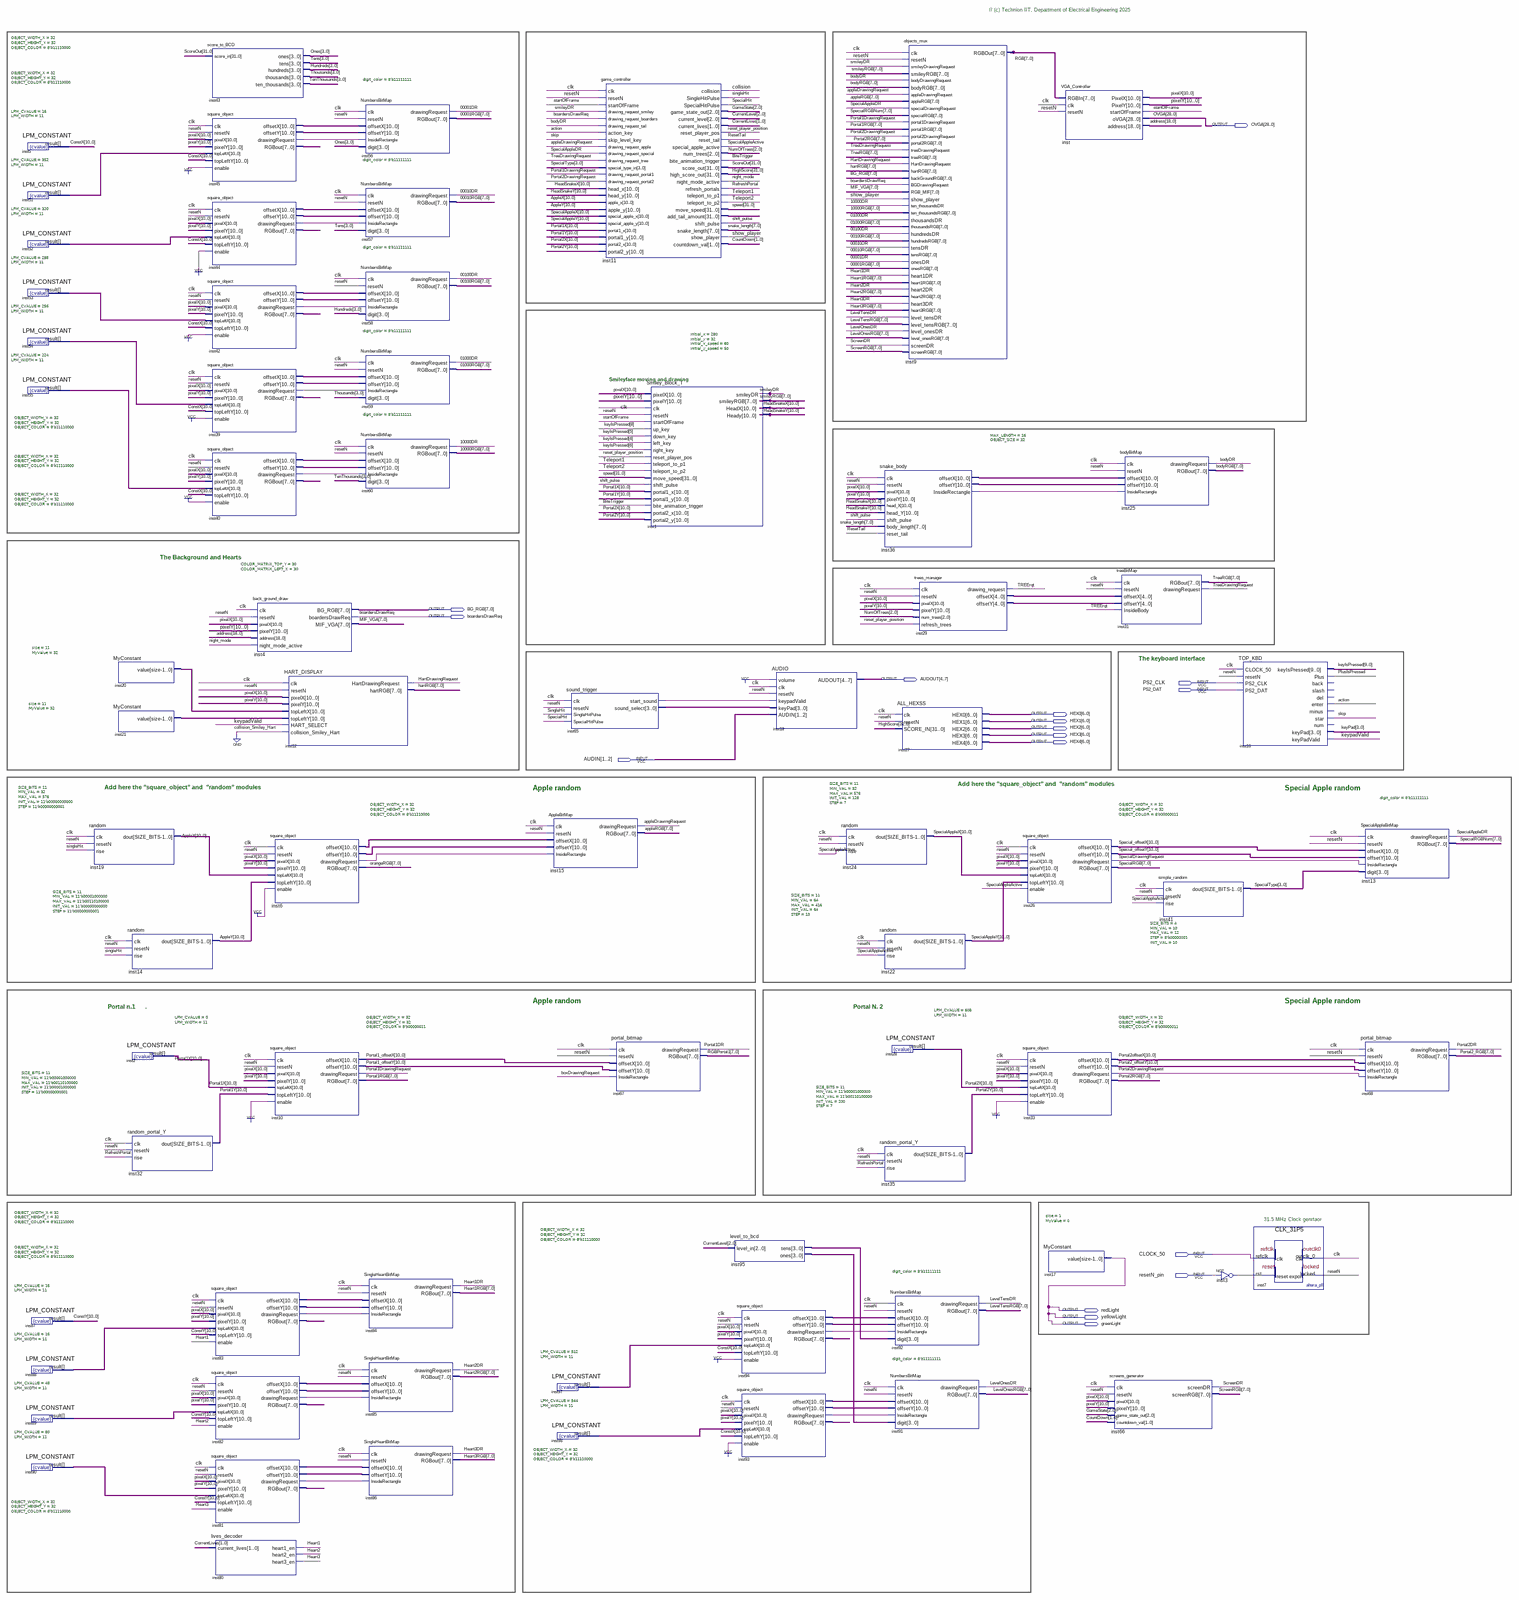
[diagram p0: schematic sheet, whole]
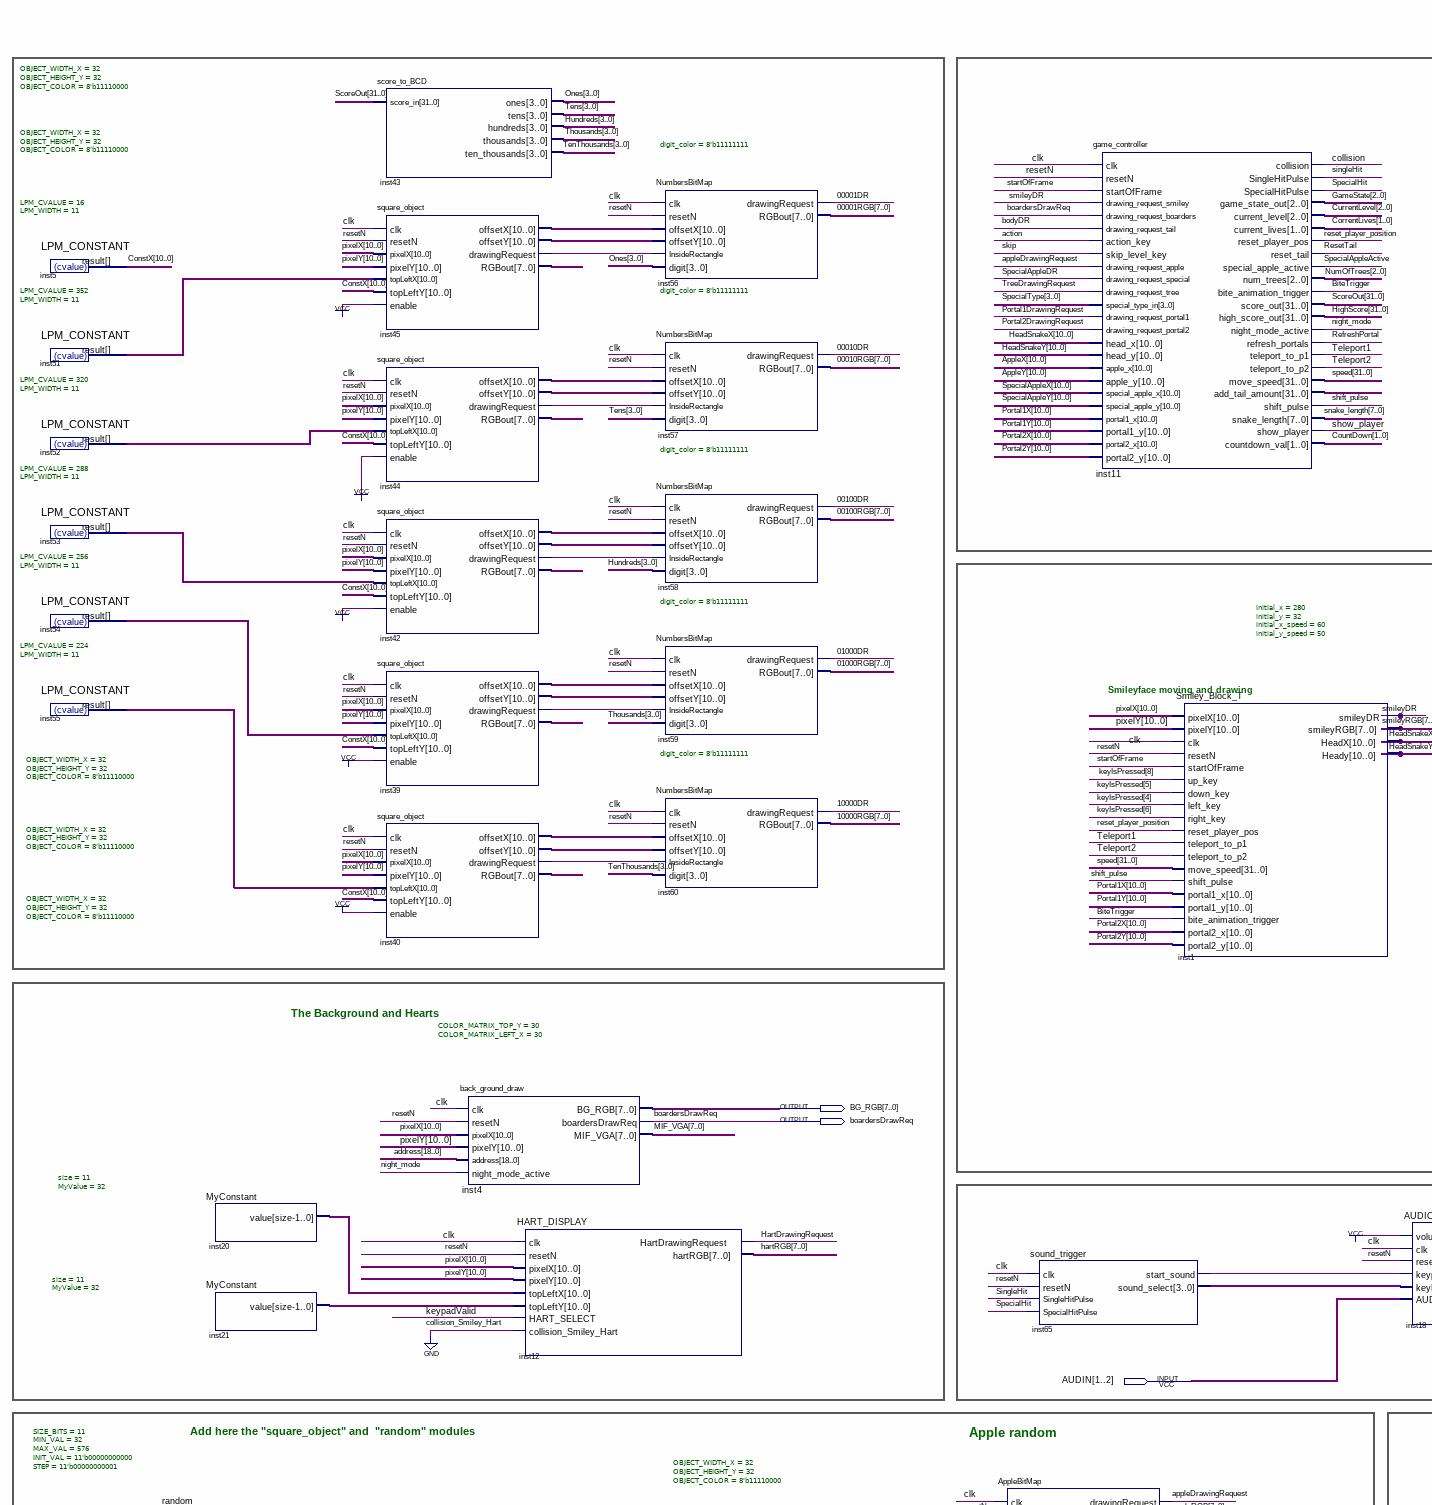
[diagram p1: schematic sheet, upper left part]
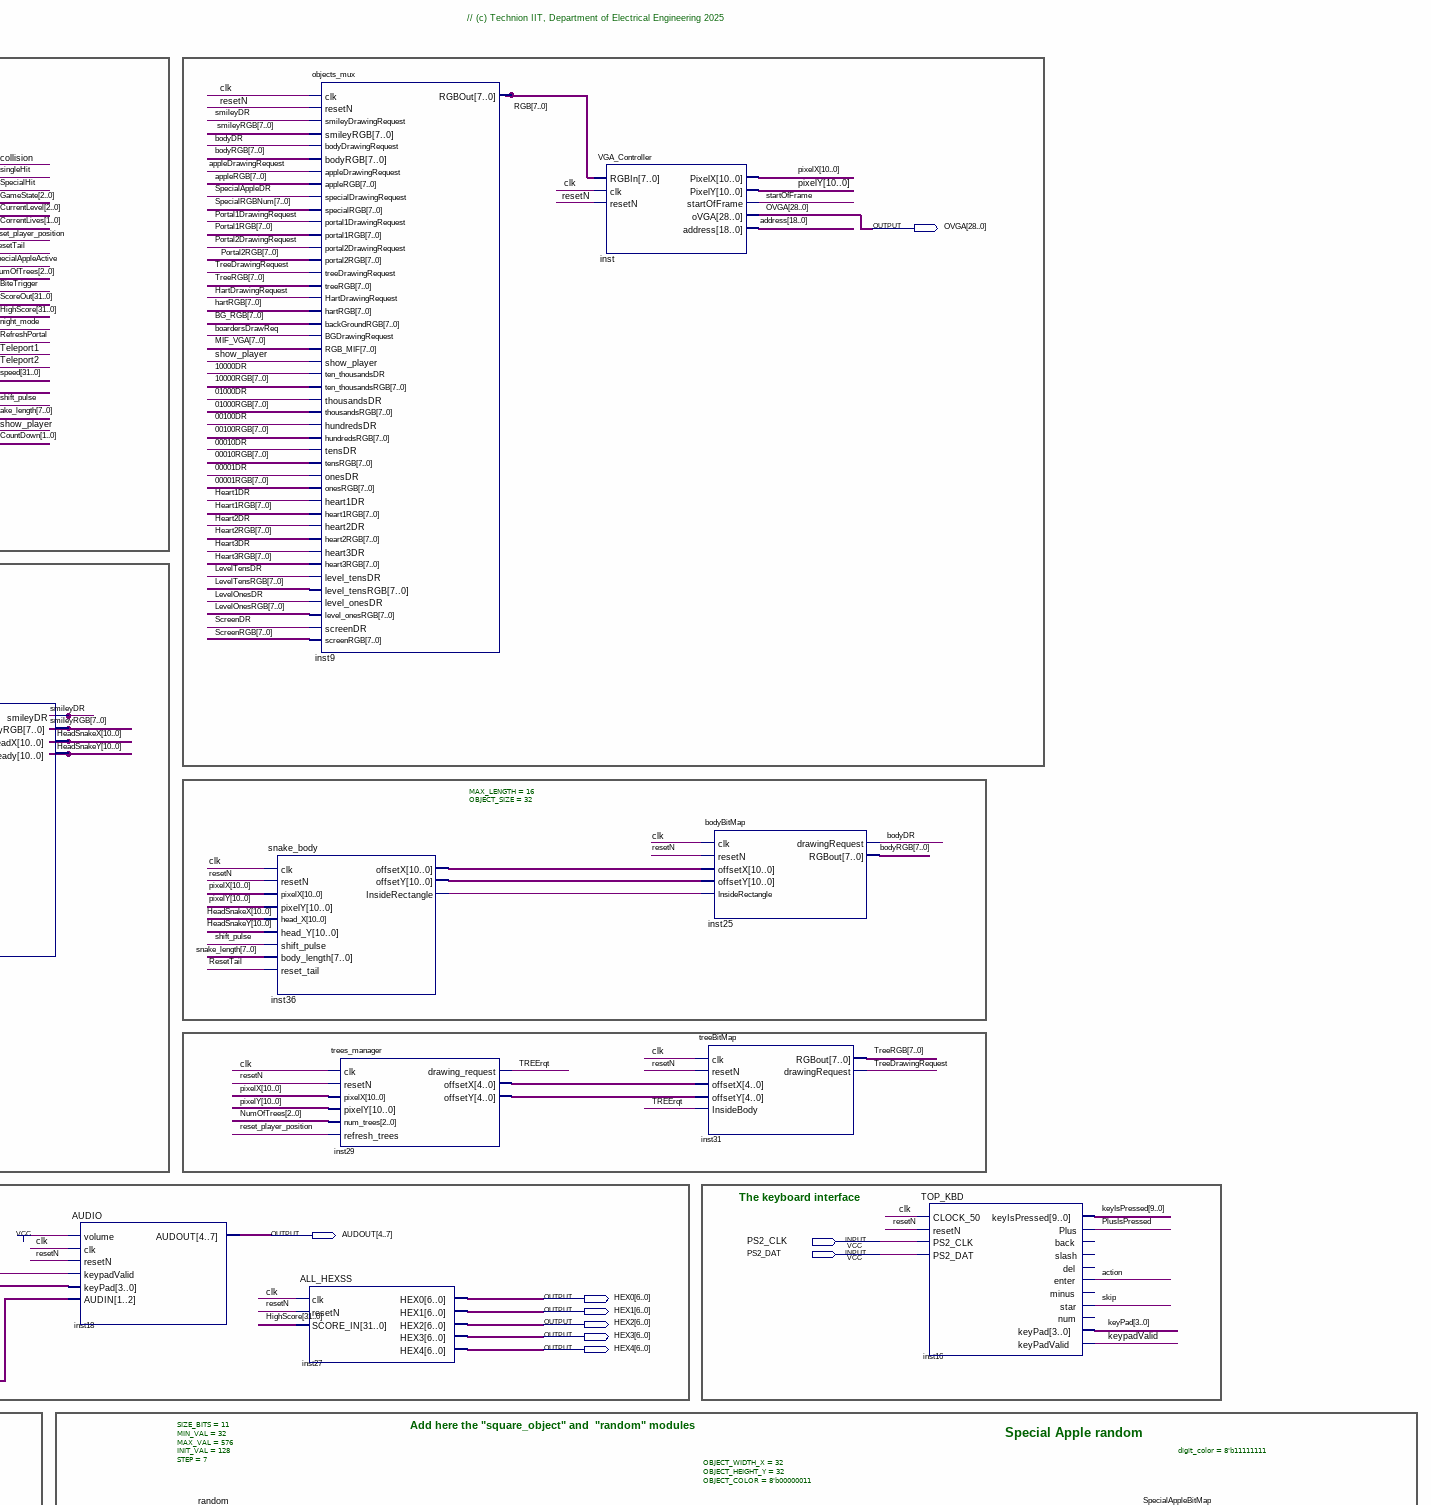
[diagram p2: schematic sheet, upper right part]
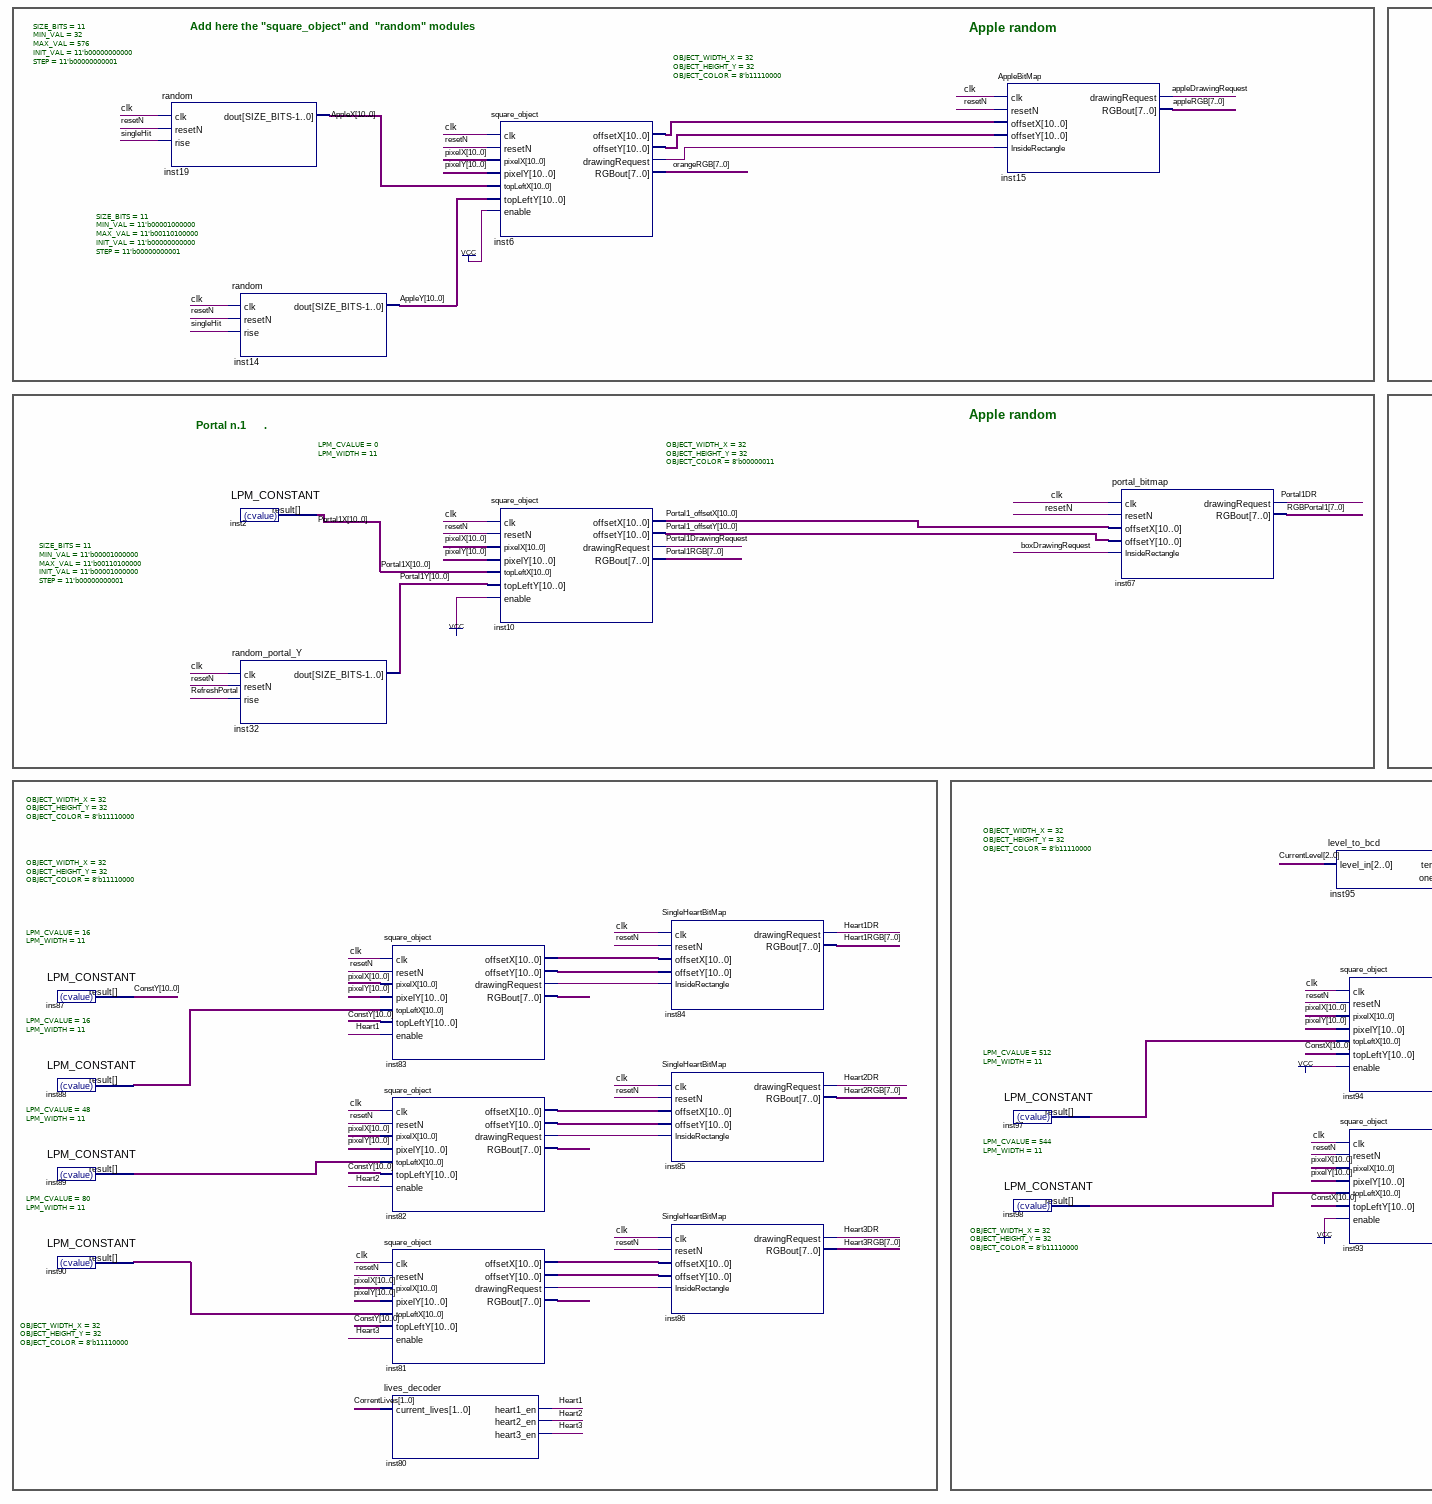
[diagram p3: schematic sheet, lower left part]
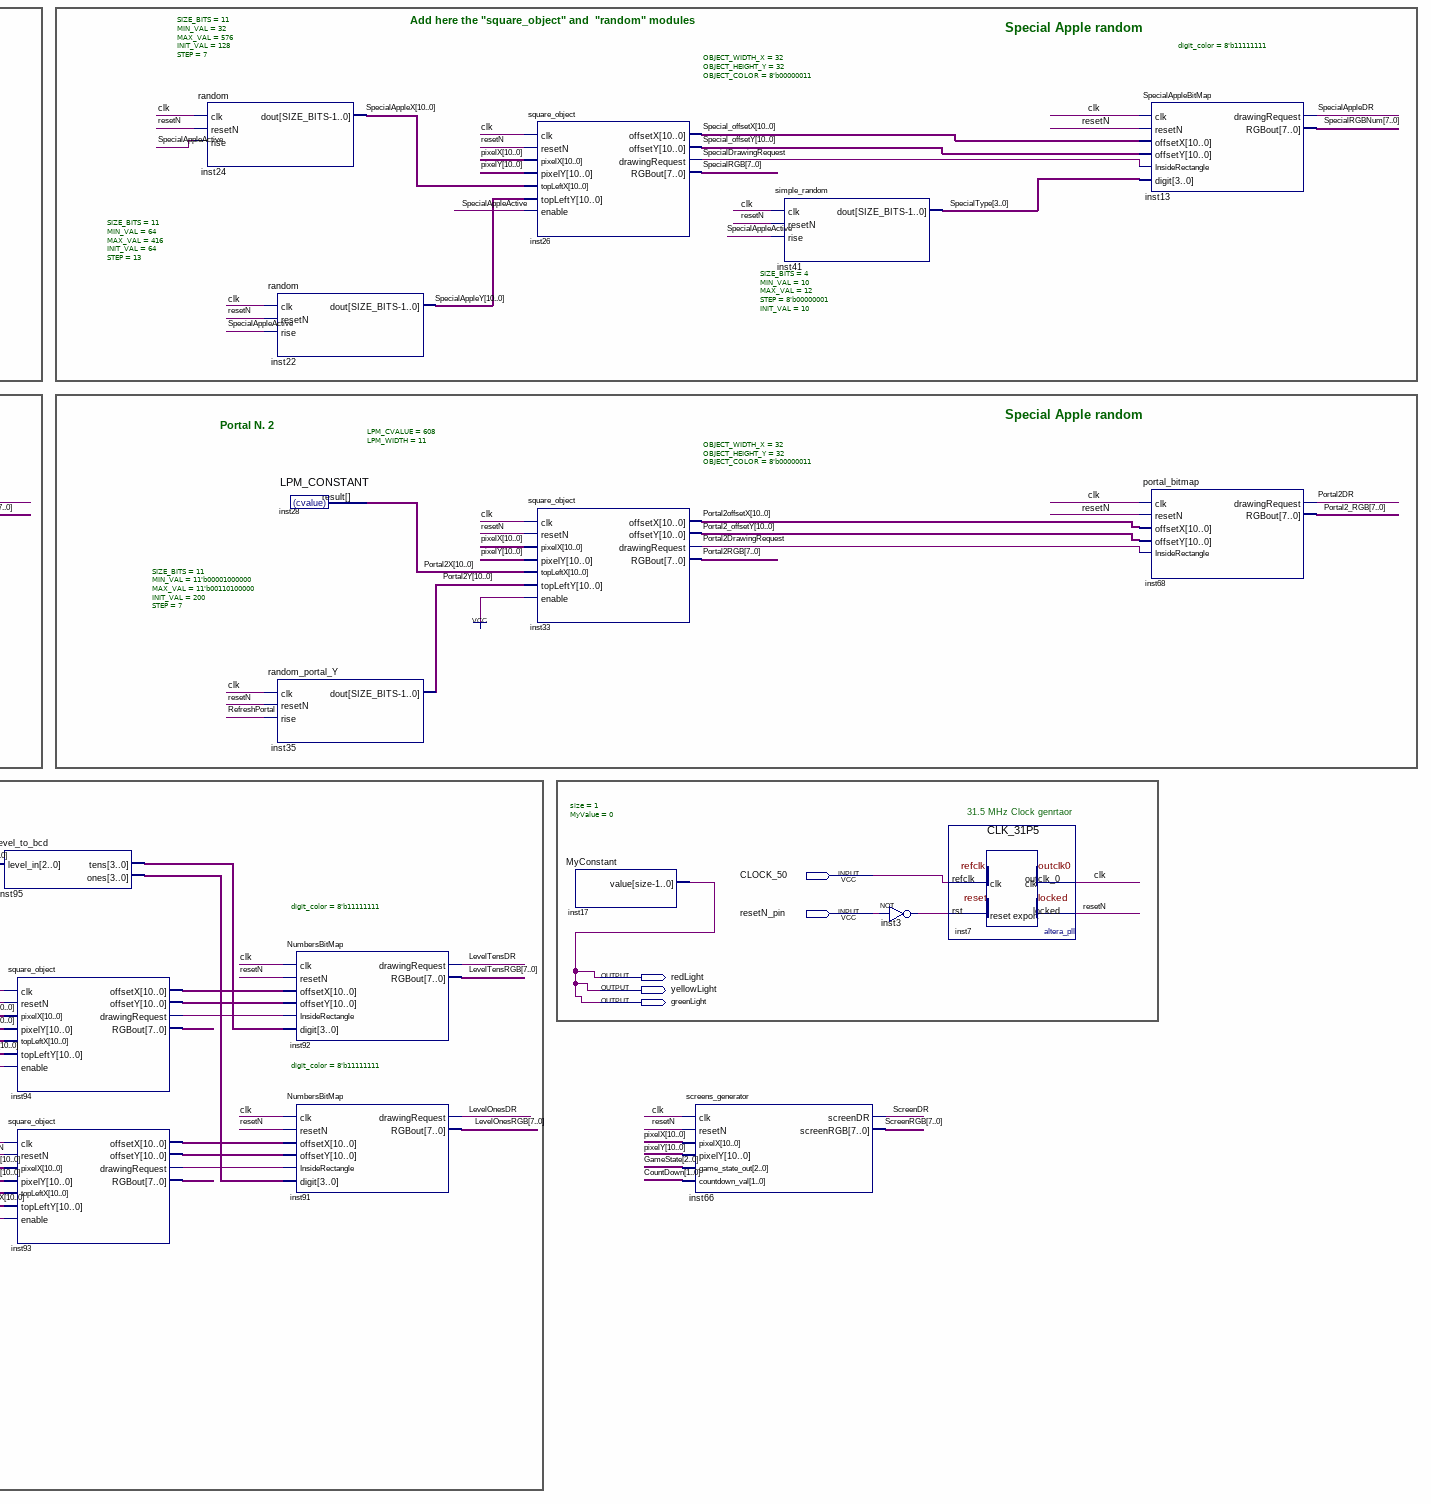
[diagram p4: schematic sheet, lower right part]
// Quartus schematic TOP_VGA_DEMO.bdf as structural Verilog: 72 symbols, 17 pins
module TOP_VGA_DEMO (
  input  PS2_CLK,
  input  PS2_DAT,
  input  [1:2] AUDIN,
  input  CLOCK_50,
  input  resetN_pin,
  output [28:0] OVGA,
  output [7:0] BG_RGB,
  output boardersDrawReq,
  output [4:7] AUDOUT,
  output [6:0] HEX0,
  output [6:0] HEX1,
  output [6:0] HEX2,
  output [6:0] HEX3,
  output [6:0] HEX4,
  output redLight,
  output yellowLight,
  output greenLight
);

  wire \00001DR , \00010DR , \00100DR , \01000DR , \10000DR , action, appleDrawingRequest, BiteTrigger,
       bodyDR, boxDrawingRequest, clk, collision, HartDrawingRequest, Heart1, Heart1DR, Heart2, Heart2DR,
       Heart3, Heart3DR, inst3_out, inst6_drawingrequest, inst36_insiderectangle, inst39_drawingrequest,
       inst40_drawingrequest, inst42_drawingrequest, inst44_drawingrequest, inst45_drawingrequest,
       inst65_start_sound, inst81_drawingrequest, inst82_drawingrequest, inst83_drawingrequest,
       inst93_drawingrequest, inst94_drawingrequest, keypadValid, LevelOnesDR, LevelTensDR, night_mode,
       PlusIsPressed, Portal1DR, Portal1DrawingRequest, Portal2DR, Portal2DrawingRequest, RefreshPortal,
       reset_player_position, resetN, ResetTail, ScreenDR, shift_pulse, show_player, singleHit, skip,
       smileyDR, SpecialAppleActive, SpecialAppleDR, SpecialDrawingRequest, SpecialHit, startOfFrame,
       Teleport1, Teleport2, TreeDrawingRequest, TREErqt;
  wire [1:0] CorrentLives, CountDown;
  wire [2:0] CurrentLevel, GameState, NumOfTrees;
  wire [3:0] Hundreds, inst65_sound_select, inst95_ones, inst95_tens, keyPad, Ones, SpecialType, Tens,
       TenThousands, Thousands;
  wire [4:0] inst29_offsetx, inst29_offsety;
  wire [7:0] \00001RGB , \00010RGB , \00100RGB , \01000RGB , \10000RGB , appleRGB, bodyRGB, hartRGB,
       Heart1RGB, Heart2RGB, Heart3RGB, inst39_rgbout, inst40_rgbout, inst42_rgbout, inst44_rgbout,
       inst45_rgbout, inst81_rgbout, inst82_rgbout, inst83_rgbout, inst93_rgbout, inst94_rgbout,
       LevelOnesRGB, LevelTensRGB, MIF_VGA, orangeRGB, Portal1RGB, Portal2_RGB, Portal2RGB, RGB, RGBPortal1,
       ScreenRGB, smileyRGB, snake_length, SpecialRGB, SpecialRGBNum, TreeRGB;
  wire [9:0] keyIsPressed;
  wire [10:0] AppleX, AppleY, ConstX, ConstY, HeadSnakeX, HeadSnakeY, inst6_offsetx, inst6_offsety,
       inst20_value, inst21_value, inst36_offsetx, inst36_offsety, inst39_offsetx, inst39_offsety,
       inst40_offsetx, inst40_offsety, inst42_offsetx, inst42_offsety, inst44_offsetx, inst44_offsety,
       inst45_offsetx, inst45_offsety, inst51_result, inst52_result, inst53_result, inst54_result,
       inst55_result, inst81_offsetx, inst81_offsety, inst82_offsetx, inst82_offsety, inst83_offsetx,
       inst83_offsety, inst88_result, inst89_result, inst90_result, inst93_offsetx, inst93_offsety,
       inst94_offsetx, inst94_offsety, inst97_result, inst98_result, pixelX, pixelY, Portal1_offsetX,
       Portal1_offsetY, Portal1X, Portal1Y, Portal2_offsetY, Portal2offsetX, Portal2X, Portal2Y,
       Special_offsetX, Special_offsetY, SpecialAppleX, SpecialAppleY;
  wire [18:0] address;
  wire [31:0] HighScore, inst11_add_tail_amount, ScoreOut, speed;

  LPM_CONSTANT #(.LPM_CVALUE(16), .LPM_WIDTH(11)) inst5 (.result(ConstX));
  LPM_CONSTANT #(.LPM_CVALUE(352), .LPM_WIDTH(11)) inst51 (.result(inst51_result));
  LPM_CONSTANT #(.LPM_CVALUE(320), .LPM_WIDTH(11)) inst52 (.result(inst52_result));
  LPM_CONSTANT #(.LPM_CVALUE(288), .LPM_WIDTH(11)) inst53 (.result(inst53_result));
  LPM_CONSTANT #(.LPM_CVALUE(256), .LPM_WIDTH(11)) inst54 (.result(inst54_result));
  LPM_CONSTANT #(.LPM_CVALUE(224), .LPM_WIDTH(11)) inst55 (.result(inst55_result));
  LPM_CONSTANT #(.LPM_CVALUE(16), .LPM_WIDTH(11)) ins87 (.result(ConstY));
  LPM_CONSTANT #(.LPM_CVALUE(16), .LPM_WIDTH(11)) inst88 (.result(inst88_result));
  LPM_CONSTANT #(.LPM_CVALUE(48), .LPM_WIDTH(11)) inst89 (.result(inst89_result));
  LPM_CONSTANT #(.LPM_CVALUE(80), .LPM_WIDTH(11)) inst90 (.result(inst90_result));
  random #(.SIZE_BITS(11), .MIN_VAL(32), .MAX_VAL(576), .INIT_VAL(11'b00000000000), .STEP(11'b00000000001)) inst19 (
    .clk(clk), .resetN(resetN), .rise(singleHit), .dout(AppleX));
  MyConstant #(.size(11), .MyValue(32)) inst20 (.value(inst20_value));
  MyConstant #(.size(11), .MyValue(32)) inst21 (.value(inst21_value));
  random #(.SIZE_BITS(11), .MIN_VAL(11'b00001000000), .MAX_VAL(11'b00110100000), .INIT_VAL(11'b00000000000), .STEP(11'b00000000001)) inst14 (
    .clk(clk), .resetN(resetN), .rise(singleHit), .dout(AppleY));
  LPM_CONSTANT #(.LPM_CVALUE(0), .LPM_WIDTH(11)) inst2 (.result(Portal1X));
  random_portal_Y #(.SIZE_BITS(11), .MIN_VAL(11'b00001000000), .MAX_VAL(11'b00110100000), .INIT_VAL(11'b00001000000), .STEP(11'b00000000001)) inst32 (
    .clk(clk), .resetN(resetN), .rise(RefreshPortal), .dout(Portal1Y));
  score_to_BCD inst43 (
    .score_in(ScoreOut), .ones(Ones), .tens(Tens), .hundreds(Hundreds), .thousands(Thousands),
    .ten_thousands(TenThousands));
  square_object #(.OBJECT_WIDTH_X(32), .OBJECT_HEIGHT_Y(32), .OBJECT_COLOR(8'b11110000)) inst45 (
    .clk(clk), .resetN(resetN), .pixelX(pixelX), .pixelY(pixelY), .topLeftX(inst51_result),
    .topLeftY(ConstX), .enable(1'b1), .offsetX(inst45_offsetx), .offsetY(inst45_offsety),
    .drawingRequest(inst45_drawingrequest), .RGBout(inst45_rgbout));
  square_object #(.OBJECT_WIDTH_X(32), .OBJECT_HEIGHT_Y(32), .OBJECT_COLOR(8'b11110000)) inst44 (
    .clk(clk), .resetN(resetN), .pixelX(pixelX), .pixelY(pixelY), .topLeftX(inst52_result),
    .topLeftY(ConstX), .enable(1'b1), .offsetX(inst44_offsetx), .offsetY(inst44_offsety),
    .drawingRequest(inst44_drawingrequest), .RGBout(inst44_rgbout));
  square_object #(.OBJECT_WIDTH_X(32), .OBJECT_HEIGHT_Y(32), .OBJECT_COLOR(8'b11110000)) inst42 (
    .clk(clk), .resetN(resetN), .pixelX(pixelX), .pixelY(pixelY), .topLeftX(inst53_result),
    .topLeftY(ConstX), .enable(1'b1), .offsetX(inst42_offsetx), .offsetY(inst42_offsety),
    .drawingRequest(inst42_drawingrequest), .RGBout(inst42_rgbout));
  square_object #(.OBJECT_WIDTH_X(32), .OBJECT_HEIGHT_Y(32), .OBJECT_COLOR(8'b11110000)) inst39 (
    .clk(clk), .resetN(resetN), .pixelX(pixelX), .pixelY(pixelY), .topLeftX(inst54_result),
    .topLeftY(ConstX), .enable(1'b1), .offsetX(inst39_offsetx), .offsetY(inst39_offsety),
    .drawingRequest(inst39_drawingrequest), .RGBout(inst39_rgbout));
  square_object #(.OBJECT_WIDTH_X(32), .OBJECT_HEIGHT_Y(32), .OBJECT_COLOR(8'b11110000)) inst40 (
    .clk(clk), .resetN(resetN), .pixelX(pixelX), .pixelY(pixelY), .topLeftX(inst55_result),
    .topLeftY(ConstX), .enable(1'b1), .offsetX(inst40_offsetx), .offsetY(inst40_offsety),
    .drawingRequest(inst40_drawingrequest), .RGBout(inst40_rgbout));
  square_object #(.OBJECT_WIDTH_X(32), .OBJECT_HEIGHT_Y(32), .OBJECT_COLOR(8'b11110000)) inst83 (
    .clk(clk), .resetN(resetN), .pixelX(pixelX), .pixelY(pixelY), .topLeftX(inst88_result),
    .topLeftY(ConstY), .enable(Heart1), .offsetX(inst83_offsetx), .offsetY(inst83_offsety),
    .drawingRequest(inst83_drawingrequest), .RGBout(inst83_rgbout));
  square_object #(.OBJECT_WIDTH_X(32), .OBJECT_HEIGHT_Y(32), .OBJECT_COLOR(8'b11110000)) inst82 (
    .clk(clk), .resetN(resetN), .pixelX(pixelX), .pixelY(pixelY), .topLeftX(inst89_result),
    .topLeftY(ConstY), .enable(Heart2), .offsetX(inst82_offsetx), .offsetY(inst82_offsety),
    .drawingRequest(inst82_drawingrequest), .RGBout(inst82_rgbout));
  square_object #(.OBJECT_WIDTH_X(32), .OBJECT_HEIGHT_Y(32), .OBJECT_COLOR(8'b11110000)) inst81 (
    .clk(clk), .resetN(resetN), .pixelX(pixelX), .pixelY(pixelY), .topLeftX(inst90_result),
    .topLeftY(ConstY), .enable(Heart3), .offsetX(inst81_offsetx), .offsetY(inst81_offsety),
    .drawingRequest(inst81_drawingrequest), .RGBout(inst81_rgbout));
  lives_decoder inst80 (.current_lives(CorrentLives), .heart1_en(Heart1), .heart2_en(Heart2), .heart3_en(Heart3));
  back_ground_draw #(.COLOR_MATRIX_TOP_Y(30), .COLOR_MATRIX_LEFT_X(30)) inst4 (
    .clk(clk), .resetN(resetN), .pixelX(pixelX), .pixelY(pixelY), .address(address),
    .night_mode_active(night_mode), .BG_RGB(BG_RGB), .boardersDrawReq(boardersDrawReq), .MIF_VGA(MIF_VGA));
  HART_DISPLAY inst12 (
    .clk(clk), .resetN(resetN), .pixelX(pixelX), .pixelY(pixelY), .topLeftX(inst20_value),
    .topLeftY(inst21_value), .HART_SELECT(keypadValid), .collision_Smiley_Hart(1'b0),
    .HartDrawingRequest(HartDrawingRequest), .hartRGB(hartRGB));
  square_object #(.OBJECT_WIDTH_X(32), .OBJECT_HEIGHT_Y(32), .OBJECT_COLOR(8'b11110000)) inst6 (
    .clk(clk), .resetN(resetN), .pixelX(pixelX), .pixelY(pixelY), .topLeftX(AppleX), .topLeftY(AppleY),
    .enable(1'b1), .offsetX(inst6_offsetx), .offsetY(inst6_offsety), .drawingRequest(inst6_drawingrequest),
    .RGBout(orangeRGB));
  square_object #(.OBJECT_WIDTH_X(32), .OBJECT_HEIGHT_Y(32), .OBJECT_COLOR(8'b00000011)) inst10 (
    .clk(clk), .resetN(resetN), .pixelX(pixelX), .pixelY(pixelY), .topLeftX(Portal1X), .topLeftY(Portal1Y),
    .enable(1'b1), .offsetX(Portal1_offsetX), .offsetY(Portal1_offsetY),
    .drawingRequest(Portal1DrawingRequest), .RGBout(Portal1RGB));
  NumbersBitMap #(.digit_color(8'b11111111)) inst56 (
    .clk(clk), .resetN(resetN), .offsetX(inst45_offsetx), .offsetY(inst45_offsety),
    .InsideRectangle(inst45_drawingrequest), .digit(Ones), .drawingRequest(\00001DR ), .RGBout(\00001RGB ));
  NumbersBitMap #(.digit_color(8'b11111111)) inst57 (
    .clk(clk), .resetN(resetN), .offsetX(inst44_offsetx), .offsetY(inst44_offsety),
    .InsideRectangle(inst44_drawingrequest), .digit(Tens), .drawingRequest(\00010DR ), .RGBout(\00010RGB ));
  NumbersBitMap #(.digit_color(8'b11111111)) inst58 (
    .clk(clk), .resetN(resetN), .offsetX(inst42_offsetx), .offsetY(inst42_offsety),
    .InsideRectangle(inst42_drawingrequest), .digit(Hundreds), .drawingRequest(\00100DR ), .RGBout(\00100RGB ));
  NumbersBitMap #(.digit_color(8'b11111111)) inst59 (
    .clk(clk), .resetN(resetN), .offsetX(inst39_offsetx), .offsetY(inst39_offsety),
    .InsideRectangle(inst39_drawingrequest), .digit(Thousands), .drawingRequest(\01000DR ),
    .RGBout(\01000RGB ));
  NumbersBitMap #(.digit_color(8'b11111111)) inst60 (
    .clk(clk), .resetN(resetN), .offsetX(inst40_offsetx), .offsetY(inst40_offsety),
    .InsideRectangle(inst40_drawingrequest), .digit(TenThousands), .drawingRequest(\10000DR ),
    .RGBout(\10000RGB ));
  SingleHeartBitMap inst84 (
    .clk(clk), .resetN(resetN), .offsetX(inst83_offsetx), .offsetY(inst83_offsety),
    .InsideRectangle(inst83_drawingrequest), .drawingRequest(Heart1DR), .RGBout(Heart1RGB));
  SingleHeartBitMap inst85 (
    .clk(clk), .resetN(resetN), .offsetX(inst82_offsetx), .offsetY(inst82_offsety),
    .InsideRectangle(inst82_drawingrequest), .drawingRequest(Heart2DR), .RGBout(Heart2RGB));
  SingleHeartBitMap inst86 (
    .clk(clk), .resetN(resetN), .offsetX(inst81_offsetx), .offsetY(inst81_offsety),
    .InsideRectangle(inst81_drawingrequest), .drawingRequest(Heart3DR), .RGBout(Heart3RGB));
  AppleBitMap inst15 (
    .clk(clk), .resetN(resetN), .offsetX(inst6_offsetx), .offsetY(inst6_offsety),
    .InsideRectangle(inst6_drawingrequest), .drawingRequest(appleDrawingRequest), .RGBout(appleRGB));
  LPM_CONSTANT #(.LPM_CVALUE(512), .LPM_WIDTH(11)) inst97 (.result(inst97_result));
  LPM_CONSTANT #(.LPM_CVALUE(544), .LPM_WIDTH(11)) inst98 (.result(inst98_result));
  sound_trigger inst65 (
    .clk(clk), .resetN(resetN), .SingleHitPulse(singleHit), .SpecialHitPulse(SpecialHit),
    .start_sound(inst65_start_sound), .sound_select(inst65_sound_select));
  game_controller inst11 (
    .clk(clk), .resetN(resetN), .startOfFrame(startOfFrame), .drawing_request_smiley(smileyDR),
    .drawing_request_boarders(boardersDrawReq), .drawing_request_tail(bodyDR), .action_key(action),
    .skip_level_key(skip), .drawing_request_apple(appleDrawingRequest),
    .drawing_request_special(SpecialAppleDR), .drawing_request_tree(TreeDrawingRequest),
    .special_type_in(SpecialType), .drawing_request_portal1(Portal1DrawingRequest),
    .drawing_request_portal2(Portal2DrawingRequest), .head_x(HeadSnakeX), .head_y(HeadSnakeY),
    .apple_x(AppleX), .apple_y(AppleY), .special_apple_x(SpecialAppleX), .special_apple_y(SpecialAppleY),
    .portal1_x(Portal1X), .portal1_y(Portal1Y), .portal2_x(Portal2X), .portal2_y(Portal2Y),
    .collision(collision), .SingleHitPulse(singleHit), .SpecialHitPulse(SpecialHit),
    .game_state_out(GameState), .current_level(CurrentLevel), .current_lives(CorrentLives),
    .reset_player_pos(reset_player_position), .reset_tail(ResetTail),
    .special_apple_active(SpecialAppleActive), .num_trees(NumOfTrees), .bite_animation_trigger(BiteTrigger),
    .score_out(ScoreOut), .high_score_out(HighScore), .night_mode_active(night_mode),
    .refresh_portals(RefreshPortal), .teleport_to_p1(Teleport1), .teleport_to_p2(Teleport2),
    .move_speed(speed), .add_tail_amount(inst11_add_tail_amount), .shift_pulse(shift_pulse),
    .snake_length(snake_length), .show_player(show_player), .countdown_val(CountDown));
  portal_bitmap inst67 (
    .clk(clk), .resetN(resetN), .offsetX(Portal1_offsetX), .offsetY(Portal1_offsetY),
    .InsideRectangle(boxDrawingRequest), .drawingRequest(Portal1DR), .RGBout(RGBPortal1));
  Smiley_Block_T #(.initial_x(280), .initial_y(32), .initial_x_speed(60), .initial_y_speed(50)) inst1 (
    .pixelX(pixelX), .pixelY(pixelY), .clk(clk), .resetN(resetN), .startOfFrame(startOfFrame),
    .up_key(keyIsPressed[8]), .down_key(keyIsPressed[5]), .left_key(keyIsPressed[4]),
    .right_key(keyIsPressed[6]), .reset_player_pos(reset_player_position), .teleport_to_p1(Teleport1),
    .teleport_to_p2(Teleport2), .move_speed(speed), .shift_pulse(shift_pulse), .portal1_x(Portal1X),
    .portal1_y(Portal1Y), .bite_animation_trigger(BiteTrigger), .portal2_x(Portal2X), .portal2_y(Portal2Y),
    .smileyDR(smileyDR), .smileyRGB(smileyRGB), .HeadX(HeadSnakeX), .Heady(HeadSnakeY));
  level_to_bcd inst95 (.level_in(CurrentLevel), .tens(inst95_tens), .ones(inst95_ones));
  square_object #(.OBJECT_WIDTH_X(32), .OBJECT_HEIGHT_Y(32), .OBJECT_COLOR(8'b11110000)) inst94 (
    .clk(clk), .resetN(resetN), .pixelX(pixelX), .pixelY(pixelY), .topLeftX(inst97_result),
    .topLeftY(ConstX), .enable(1'b1), .offsetX(inst94_offsetx), .offsetY(inst94_offsety),
    .drawingRequest(inst94_drawingrequest), .RGBout(inst94_rgbout));
  square_object #(.OBJECT_WIDTH_X(32), .OBJECT_HEIGHT_Y(32), .OBJECT_COLOR(8'b11110000)) inst93 (
    .clk(clk), .resetN(resetN), .pixelX(pixelX), .pixelY(pixelY), .topLeftX(inst98_result),
    .topLeftY(ConstX), .enable(1'b1), .offsetX(inst93_offsetx), .offsetY(inst93_offsety),
    .drawingRequest(inst93_drawingrequest), .RGBout(inst93_rgbout));
  AUDIO inst18 (
    .volume(1'b1), .clk(clk), .resetN(resetN), .keypadValid(inst65_start_sound),
    .keyPad(inst65_sound_select), .AUDIN(AUDIN), .AUDOUT(AUDOUT));
  random #(.SIZE_BITS(11), .MIN_VAL(32), .MAX_VAL(576), .INIT_VAL(128), .STEP(7)) inst24 (
    .clk(clk), .resetN(resetN), .rise(SpecialAppleActive), .dout(SpecialAppleX));
  snake_body #(.MAX_LENGTH(16), .OBJECT_SIZE(32)) inst36 (
    .clk(clk), .resetN(resetN), .pixelX(pixelX), .pixelY(pixelY), .head_X(HeadSnakeX), .head_Y(HeadSnakeY),
    .shift_pulse(shift_pulse), .body_length(snake_length), .reset_tail(ResetTail), .offsetX(inst36_offsetx),
    .offsetY(inst36_offsety), .InsideRectangle(inst36_insiderectangle));
  ALL_HEXSS inst27 (
    .clk(clk), .resetN(resetN), .SCORE_IN(HighScore), .HEX0(HEX0), .HEX1(HEX1), .HEX2(HEX2), .HEX3(HEX3),
    .HEX4(HEX4));
  random #(.SIZE_BITS(11), .MIN_VAL(64), .MAX_VAL(416), .INIT_VAL(64), .STEP(13)) inst22 (
    .clk(clk), .resetN(resetN), .rise(SpecialAppleActive), .dout(SpecialAppleY));
  LPM_CONSTANT #(.LPM_CVALUE(608), .LPM_WIDTH(11)) inst28 (.result(Portal2X));
  random_portal_Y #(.SIZE_BITS(11), .MIN_VAL(11'b00001000000), .MAX_VAL(11'b00110100000), .INIT_VAL(200), .STEP(7)) inst35 (
    .clk(clk), .resetN(resetN), .rise(RefreshPortal), .dout(Portal2Y));
  NumbersBitMap #(.digit_color(8'b11111111)) inst92 (
    .clk(clk), .resetN(resetN), .offsetX(inst94_offsetx), .offsetY(inst94_offsety),
    .InsideRectangle(inst94_drawingrequest), .digit(inst95_tens), .drawingRequest(LevelTensDR),
    .RGBout(LevelTensRGB));
  NumbersBitMap #(.digit_color(8'b11111111)) inst91 (
    .clk(clk), .resetN(resetN), .offsetX(inst93_offsetx), .offsetY(inst93_offsety),
    .InsideRectangle(inst93_drawingrequest), .digit(inst95_ones), .drawingRequest(LevelOnesDR),
    .RGBout(LevelOnesRGB));
  objects_mux inst9 (
    .clk(clk), .resetN(resetN), .smileyDrawingRequest(smileyDR), .smileyRGB(smileyRGB),
    .bodyDrawingRequest(bodyDR), .bodyRGB(bodyRGB), .appleDrawingRequest(appleDrawingRequest),
    .appleRGB(appleRGB), .specialDrawingRequest(SpecialAppleDR), .specialRGB(SpecialRGBNum),
    .portal1DrawingRequest(Portal1DrawingRequest), .portal1RGB(Portal1RGB),
    .portal2DrawingRequest(Portal2DrawingRequest), .portal2RGB(Portal2RGB),
    .treeDrawingRequest(TreeDrawingRequest), .treeRGB(TreeRGB), .HartDrawingRequest(HartDrawingRequest),
    .hartRGB(hartRGB), .backGroundRGB(BG_RGB), .BGDrawingRequest(boardersDrawReq), .RGB_MIF(MIF_VGA),
    .show_player(show_player), .ten_thousandsDR(\10000DR ), .ten_thousandsRGB(\10000RGB ),
    .thousandsDR(\01000DR ), .thousandsRGB(\01000RGB ), .hundredsDR(\00100DR ), .hundredsRGB(\00100RGB ),
    .tensDR(\00010DR ), .tensRGB(\00010RGB ), .onesDR(\00001DR ), .onesRGB(\00001RGB ), .heart1DR(Heart1DR),
    .heart1RGB(Heart1RGB), .heart2DR(Heart2DR), .heart2RGB(Heart2RGB), .heart3DR(Heart3DR),
    .heart3RGB(Heart3RGB), .level_tensDR(LevelTensDR), .level_tensRGB(LevelTensRGB),
    .level_onesDR(LevelOnesDR), .level_onesRGB(LevelOnesRGB), .screenDR(ScreenDR), .screenRGB(ScreenRGB),
    .RGBOut(RGB));
  trees_manager inst29 (
    .clk(clk), .resetN(resetN), .pixelX(pixelX), .pixelY(pixelY), .num_trees(NumOfTrees),
    .refresh_trees(reset_player_position), .drawing_request(TREErqt), .offsetX(inst29_offsetx),
    .offsetY(inst29_offsety));
  square_object #(.OBJECT_WIDTH_X(32), .OBJECT_HEIGHT_Y(32), .OBJECT_COLOR(8'b00000011)) inst26 (
    .clk(clk), .resetN(resetN), .pixelX(pixelX), .pixelY(pixelY), .topLeftX(SpecialAppleX),
    .topLeftY(SpecialAppleY), .enable(SpecialAppleActive), .offsetX(Special_offsetX),
    .offsetY(Special_offsetY), .drawingRequest(SpecialDrawingRequest), .RGBout(SpecialRGB));
  square_object #(.OBJECT_WIDTH_X(32), .OBJECT_HEIGHT_Y(32), .OBJECT_COLOR(8'b00000011)) inst33 (
    .clk(clk), .resetN(resetN), .pixelX(pixelX), .pixelY(pixelY), .topLeftX(Portal2X), .topLeftY(Portal2Y),
    .enable(1'b1), .offsetX(Portal2offsetX), .offsetY(Portal2_offsetY),
    .drawingRequest(Portal2DrawingRequest), .RGBout(Portal2RGB));
  VGA_Controller inst (
    .RGBIn(RGB), .clk(clk), .resetN(resetN), .PixelX(pixelX), .PixelY(pixelY), .startOfFrame(startOfFrame),
    .oVGA(OVGA), .address(address));
  MyConstant #(.size(1), .MyValue(0)) inst17 (.value(greenLight));
  bodyBitMap inst25 (
    .clk(clk), .resetN(resetN), .offsetX(inst36_offsetx), .offsetY(inst36_offsety),
    .InsideRectangle(inst36_insiderectangle), .drawingRequest(bodyDR), .RGBout(bodyRGB));
  treeBitMap inst31 (
    .clk(clk), .resetN(resetN), .offsetX(inst29_offsetx), .offsetY(inst29_offsety), .InsideBody(TREErqt),
    .RGBout(TreeRGB), .drawingRequest(TreeDrawingRequest));
  screens_generator inst66 (
    .clk(clk), .resetN(resetN), .pixelX(pixelX), .pixelY(pixelY), .game_state_out(GameState),
    .countdown_val(CountDown), .screenDR(ScreenDR), .screenRGB(ScreenRGB));
  simple_random #(.SIZE_BITS(4), .MIN_VAL(10), .MAX_VAL(12), .STEP(8'b00000001), .INIT_VAL(10)) inst41 (
    .clk(clk), .resetN(resetN), .rise(SpecialAppleActive), .dout(SpecialType));
  not inst3 (inst3_out, resetN_pin);
  TOP_KBD inst16 (
    .CLOCK_50(clk), .resetN(resetN), .PS2_CLK(PS2_CLK), .PS2_DAT(PS2_DAT), .keyIsPressed(keyIsPressed),
    .Plus(PlusIsPressed), .enter(action), .star(skip), .keyPad(keyPad), .keyPadValid(keypadValid));  // open: back, slash, del, minus, num
  CLK_31P5 inst7 (.refclk(CLOCK_50), .rst(inst3_out), .outclk_0(clk), .locked(resetN));
  SpecialAppleBitMap #(.digit_color(8'b11111111)) inst13 (
    .clk(clk), .resetN(resetN), .offsetX(Special_offsetX), .offsetY(Special_offsetY),
    .InsideRectangle(SpecialDrawingRequest), .digit(SpecialType), .drawingRequest(SpecialAppleDR),
    .RGBout(SpecialRGBNum));
  portal_bitmap inst68 (
    .clk(clk), .resetN(resetN), .offsetX(Portal2offsetX), .offsetY(Portal2_offsetY),
    .InsideRectangle(Portal2DrawingRequest), .drawingRequest(Portal2DR), .RGBout(Portal2_RGB));

  assign redLight = greenLight;
  assign yellowLight = greenLight;

  // Notes on the sheet:
  //   // (c) Technion IIT, Department of Electrical Engineering 2025
  //   Smileyface moving and drawing
  //   The Background and Hearts
  //   The keyboard interface
  //   Add here the "square_object" and  "random" modules
  //   Add here the "square_object" and  "random" modules
  //   Apple random
  //   Special Apple random
  //   Apple random
  //   Special Apple random
  //   Portal n.1      .
  //   Portal N. 2
  //   31.5 MHz Clock genrtaor
endmodule
